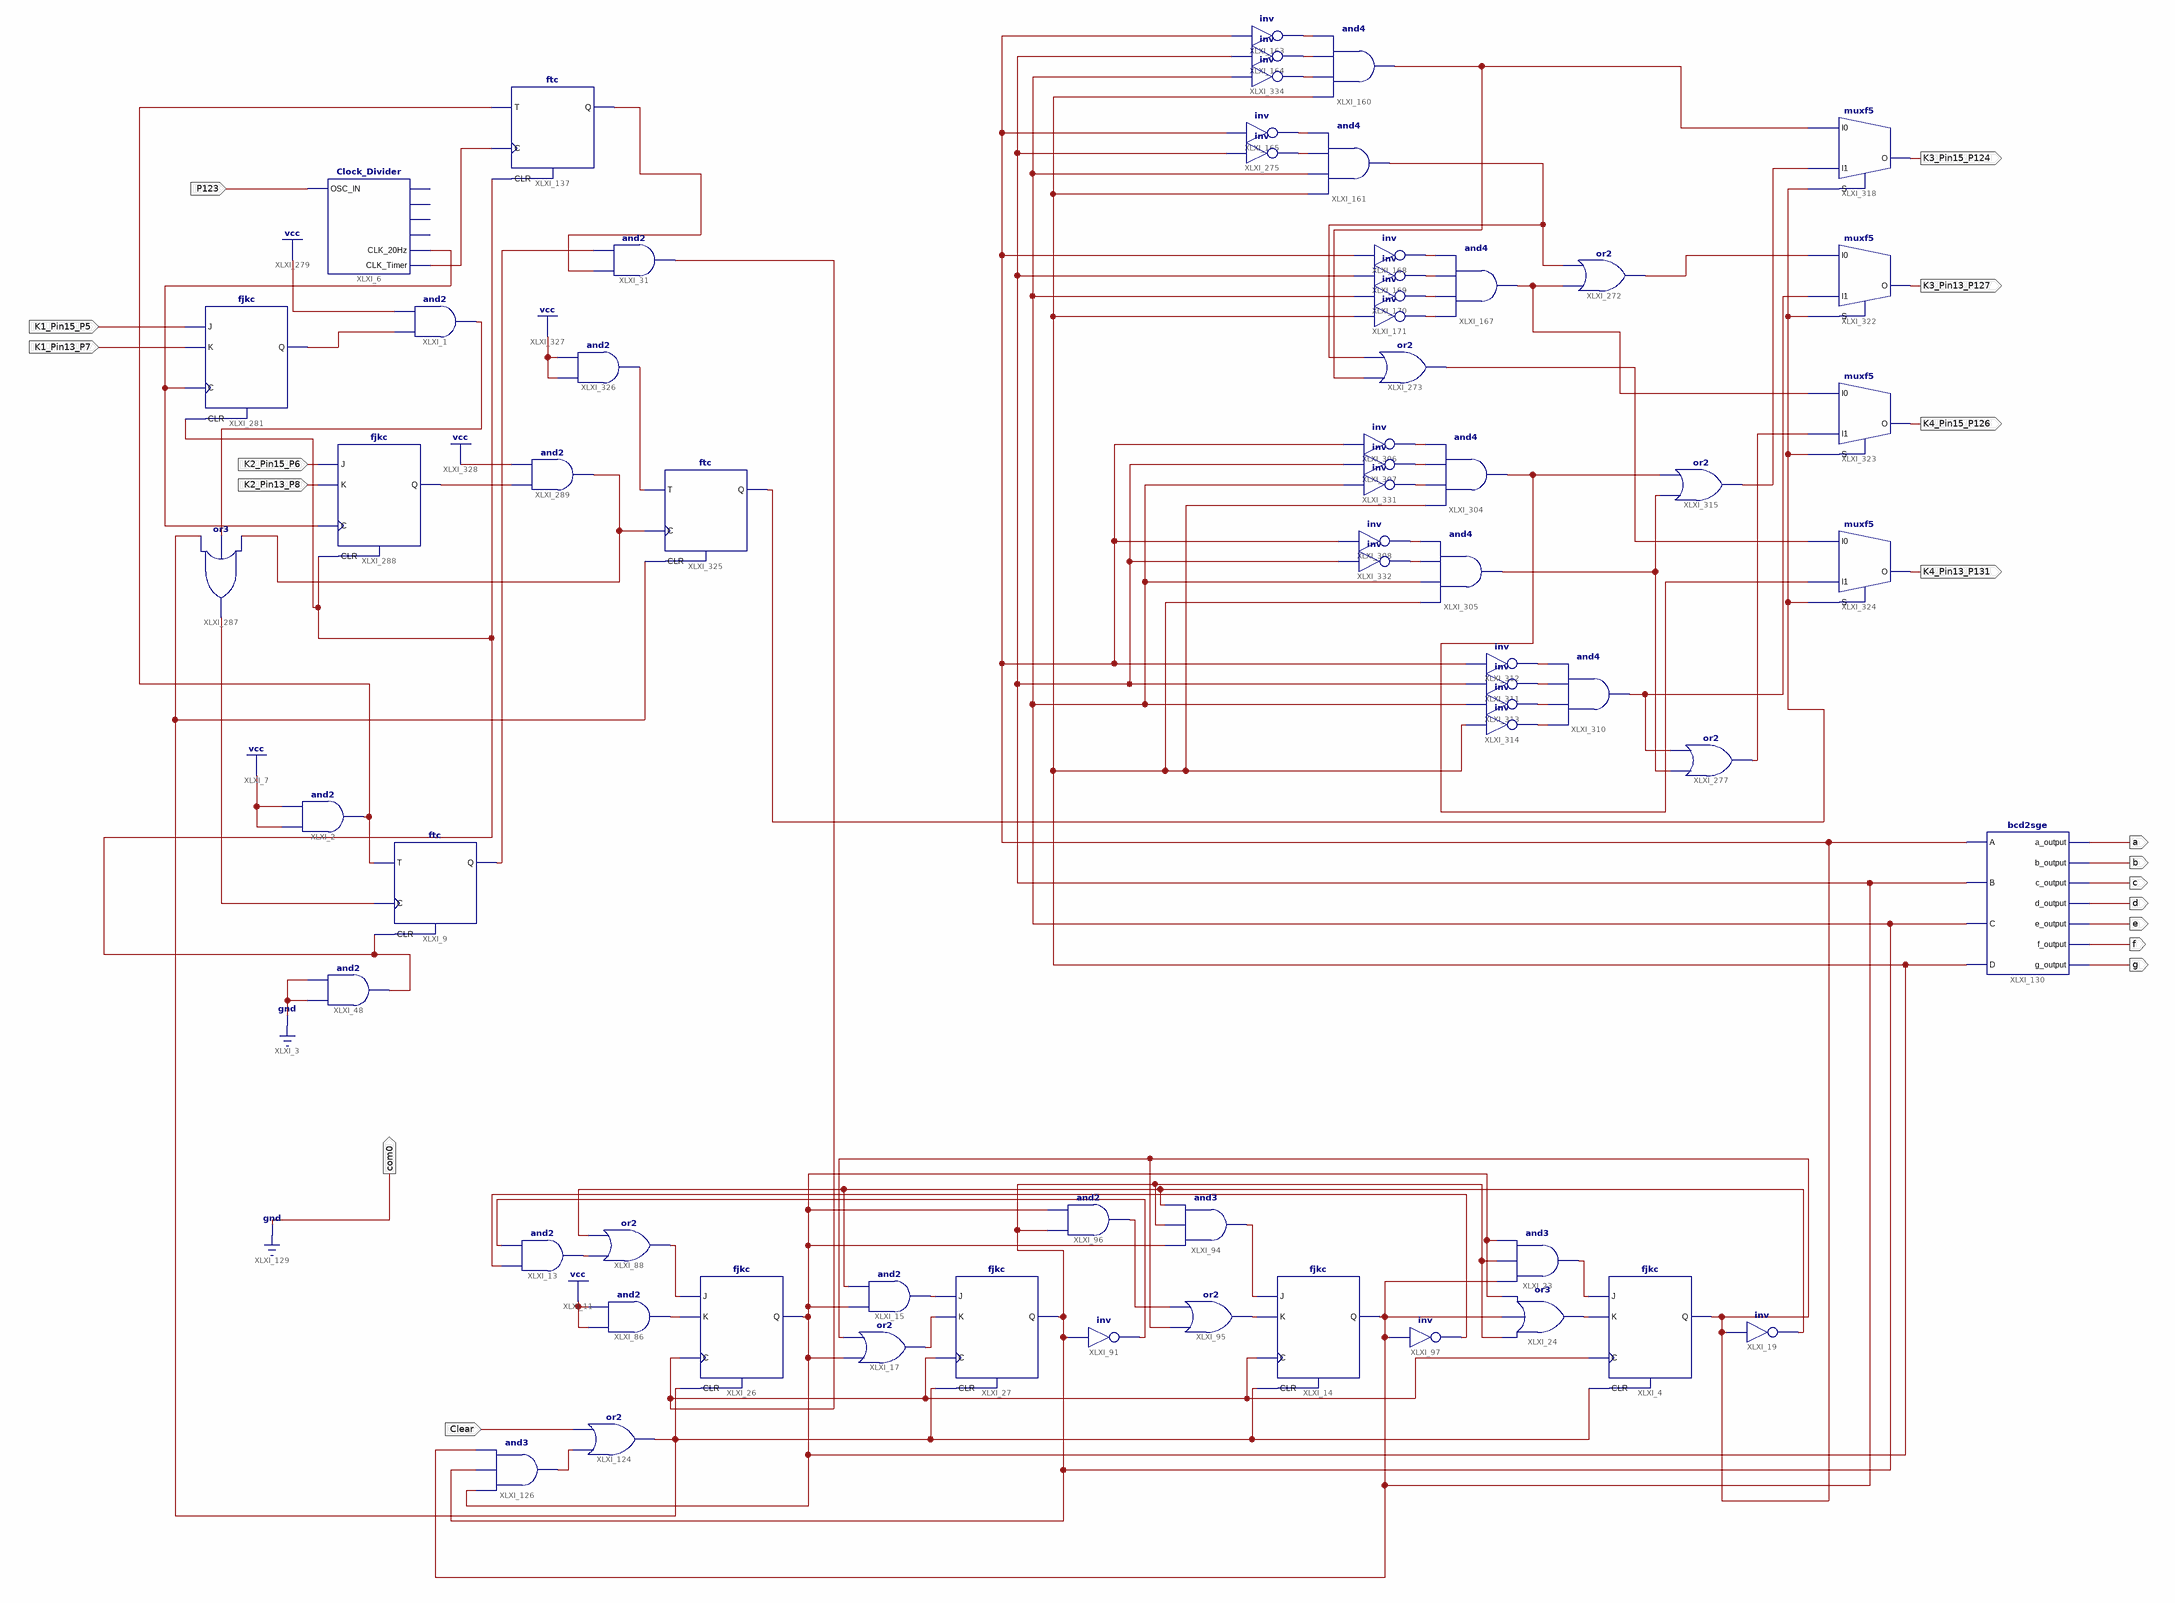
[diagram p0: schematic sheet 1]
// Xilinx ISE schematic fpga_test.sch (spartan6) as structural Verilog: 65 symbols, 18 ports
module fpga_test (
  input  Clear,
  input  K1_Pin13_P7,
  input  K1_Pin15_P5,
  input  K2_Pin15_P6,
  input  K2_Pin13_P8,
  input  P123,
  output a,
  output b,
  output c,
  output d,
  output e,
  output f,
  output g,
  output com0,
  output K4_Pin13_P131,
  output K4_Pin15_P126,
  output K3_Pin13_P127,
  output K3_Pin15_P124
);

  wire Clearasdasd, CLK_IN, D0, D3, LED1, LED2, LED_01, LED_02, LED_03, LED_04, XLXN_12, XLXN_14, XLXN_22,
       XLXN_23, XLXN_45, XLXN_84, XLXN_86, XLXN_88, XLXN_90, XLXN_95, XLXN_96, XLXN_121, XLXN_155, XLXN_156,
       XLXN_222, XLXN_296, XLXN_297, XLXN_348, XLXN_349, XLXN_350, XLXN_354, XLXN_355, XLXN_356, XLXN_359,
       XLXN_360, XLXN_361, XLXN_362, XLXN_363, XLXN_364, XLXN_365, XLXN_491, XLXN_565, XLXN_567, XLXN_576,
       XLXN_614, XLXN_621, XLXN_622, XLXN_658, XLXN_663, XLXN_668, XLXN_671, XLXN_672, XLXN_675, XLXN_679,
       XLXN_685, XLXN_708, XLXN_709, XLXN_710, XLXN_711, XLXN_714, XLXN_717;

  and XLXI_1 (XLXN_155, XLXN_576, 1'b1);
  and XLXI_2 (XLXN_711, 1'b1, 1'b1);
  and XLXI_48 (XLXN_714, 1'b0, 1'b0);
  Clock_Divider XLXI_6 (
    .OSC_IN(P123), .CLK_20Hz(XLXN_717), .CLK_Timer(XLXN_296));  // open: CLK_1Hz, CLK_2Hz, CLK_500Hz, CLK_TEST
  ftc XLXI_9 (.C(XLXN_614), .CLR(XLXN_714), .T(XLXN_711), .Q(XLXN_45));
  and XLXI_86 (XLXN_12, 1'b1, 1'b1);
  or XLXI_88 (XLXN_491, XLXN_14, XLXN_86);
  and XLXI_13 (XLXN_14, XLXN_22, XLXN_222);
  fjkc XLXI_14 (.C(CLK_IN), .CLR(Clearasdasd), .J(XLXN_121), .K(XLXN_88), .Q(LED1));
  not XLXI_91 (XLXN_222, LED2);
  and XLXI_15 (XLXN_23, D0, XLXN_86);
  or XLXI_17 (XLXN_84, D0, D3);
  and XLXI_94 (XLXN_121, D0, LED2, XLXN_86);
  or XLXI_95 (XLXN_88, D3, XLXN_90);
  and XLXI_96 (XLXN_90, LED2, D0);
  not XLXI_97 (XLXN_22, LED1);
  fjkc XLXI_4 (.C(CLK_IN), .CLR(Clearasdasd), .J(XLXN_96), .K(XLXN_95), .Q(D3));
  and XLXI_23 (XLXN_96, LED1, LED2, D0);
  or XLXI_24 (XLXN_95, LED2, LED1, D0);
  not XLXI_19 (XLXN_86, D3);
  fjkc XLXI_26 (.C(CLK_IN), .CLR(Clearasdasd), .J(XLXN_491), .K(XLXN_12), .Q(D0));
  fjkc XLXI_27 (.C(CLK_IN), .CLR(Clearasdasd), .J(XLXN_23), .K(XLXN_84), .Q(LED2));
  or XLXI_124 (Clearasdasd, XLXN_156, Clear);
  and XLXI_126 (XLXN_156, D0, LED2, LED1);
  bcd2sge XLXI_130 (
    .A(D3), .B(LED1), .C(LED2), .D(D0), .a_output(a), .b_output(b), .c_output(c), .d_output(d), .e_output(e),
    .f_output(f), .g_output(g));
  and XLXI_31 (CLK_IN, XLXN_297, XLXN_45);
  ftc XLXI_137 (.C(XLXN_296), .CLR(XLXN_714), .T(XLXN_711), .Q(XLXN_297));
  fjkc XLXI_281 (.C(XLXN_717), .CLR(XLXN_714), .J(K1_Pin15_P5), .K(K1_Pin13_P7), .Q(XLXN_576));
  or XLXI_287 (XLXN_614, Clearasdasd, XLXN_155, XLXN_622);
  fjkc XLXI_288 (.C(XLXN_717), .CLR(XLXN_714), .J(K2_Pin15_P6), .K(K2_Pin13_P8), .Q(XLXN_621));
  and XLXI_289 (XLXN_622, XLXN_621, 1'b1);
  and XLXI_160 (LED_01, D0, XLXN_710, XLXN_349, XLXN_348);
  and XLXI_161 (XLXN_565, D0, LED2, XLXN_567, XLXN_350);
  not XLXI_163 (XLXN_348, D3);
  not XLXI_165 (XLXN_350, D3);
  and XLXI_167 (LED_03, XLXN_362, XLXN_361, XLXN_359, XLXN_360);
  not XLXI_169 (XLXN_359, LED1);
  not XLXI_168 (XLXN_360, D3);
  not XLXI_170 (XLXN_361, LED2);
  not XLXI_171 (XLXN_362, D0);
  or XLXI_272 (LED_02, LED_03, XLXN_565);
  or XLXI_273 (LED_04, LED_01, XLXN_565);
  not XLXI_275 (XLXN_567, LED1);
  and XLXI_304 (XLXN_663, D0, XLXN_709, XLXN_355, XLXN_354);
  and XLXI_305 (XLXN_668, D0, LED2, XLXN_708, XLXN_356);
  not XLXI_306 (XLXN_354, D3);
  not XLXI_307 (XLXN_355, LED1);
  not XLXI_308 (XLXN_356, D3);
  and XLXI_310 (XLXN_675, XLXN_365, XLXN_364, XLXN_658, XLXN_363);
  not XLXI_311 (XLXN_658, LED1);
  not XLXI_312 (XLXN_363, D3);
  not XLXI_313 (XLXN_364, LED2);
  not XLXI_314 (XLXN_365, D0);
  or XLXI_315 (XLXN_671, XLXN_668, XLXN_663);
  or XLXI_277 (XLXN_679, XLXN_668, XLXN_675);
  muxf5 XLXI_318 (.I0(LED_01), .I1(XLXN_671), .S(XLXN_672), .O(K3_Pin15_P124));
  muxf5 XLXI_322 (.I0(LED_02), .I1(XLXN_675), .S(XLXN_672), .O(K3_Pin13_P127));
  muxf5 XLXI_323 (.I0(LED_03), .I1(XLXN_679), .S(XLXN_672), .O(K4_Pin15_P126));
  muxf5 XLXI_324 (.I0(LED_04), .I1(XLXN_663), .S(XLXN_672), .O(K4_Pin13_P131));
  ftc XLXI_325 (.C(XLXN_622), .CLR(Clearasdasd), .T(XLXN_685), .Q(XLXN_672));
  and XLXI_326 (XLXN_685, 1'b1, 1'b1);
  not XLXI_332 (XLXN_708, LED1);
  not XLXI_331 (XLXN_709, LED2);
  not XLXI_164 (XLXN_349, LED1);
  not XLXI_334 (XLXN_710, LED2);

  assign com0 = 1'b0;
endmodule
